# EAGLE design Rod_I2C_Extender_FFC (EAGLE 9.6.2)
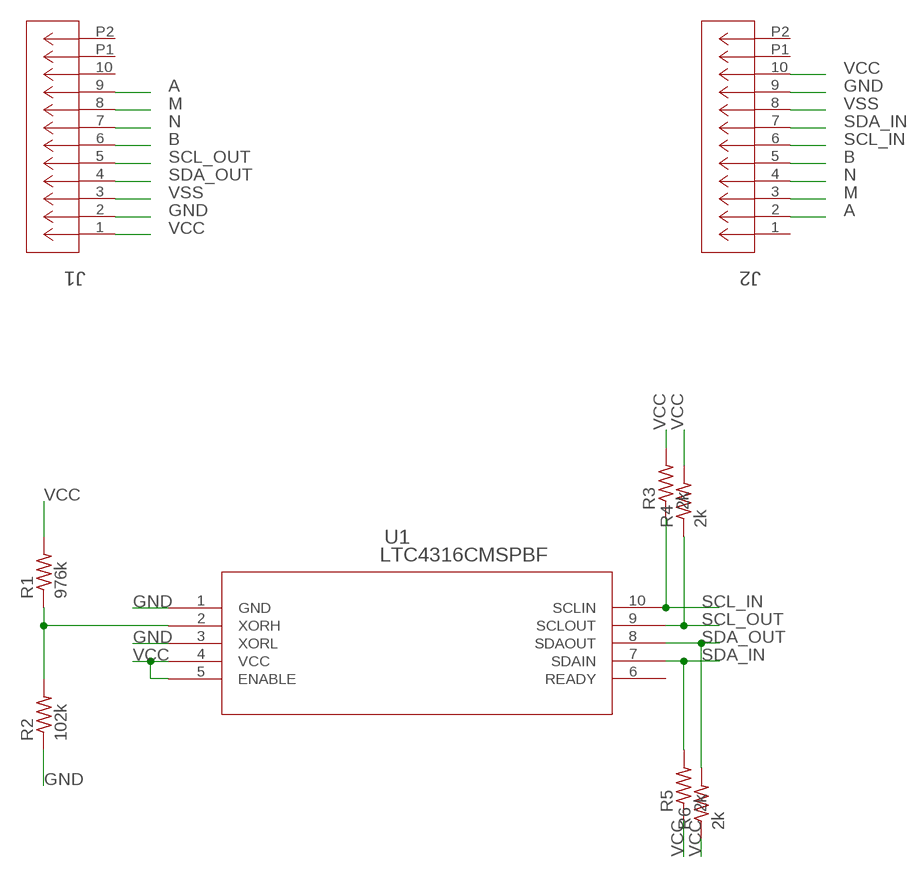
[diagram p0: schematic, sheet 1]

## Parts
J1  522711079  [CON_522711079_MOL]
J2  522711079  [CON_522711079_MOL]
R1  976k  R-US_R0603  [R0603]
R2  102k  R-US_R0603  [R0603]
R3  2k  R-US_R0603  [R0603]
R4  2k  R-US_R0603  [R0603]
R5  2k  R-US_R0603  [R0603]
R6  2k  R-US_R0603  [R0603]
U1  LTC4316CMSPBF  [MSOP-10_MS]

## Nets
A: J1.9 J2.2
B: J1.6 J2.5
GND: J1.2 J2.9 R2.1 U1.1(GND) U1.3(XORL)
M: J1.8 J2.3
N: J1.7 J2.4
N$3: R1.1 R2.2 U1.2(XORH)
SCL_IN: J2.6 R3.1 U1.10(SCLIN)
SCL_OUT: J1.5 R4.1 U1.9(SCLOUT)
SDA_IN: J2.7 R5.2 U1.7(SDAIN)
SDA_OUT: J1.4 R6.2 U1.8(SDAOUT)
VCC: J1.1 J2.10 R1.2 R3.2 R4.2 R5.1 R6.1 U1.4(VCC) U1.5(ENABLE)
VSS: J1.3 J2.8
Unconnected: J1.10 J1.P1 J1.P2 J2.1 J2.P1 J2.P2 U1.6(READY)

## Library data of the parts
J1 J2 = 0522711079:522711079; COPYRIGHT: Copyright (C) 2023 Ultra Librarian. All rights reserved.; MANUFACTURER_PART_NUMBER: 522711079; MFR_NAME: Molex Connector Corporation
R1-R6 = adafruit:R-US_: RESISTOR, American symbol
U1 = LTC4316CMSPBF:LTC4316CMSPBF: Check prices <https://pricing.snapeda.com/parts/LTC4316CMS%23PBF/Analog%20Devices/view-part?ref=eda>; AVAILABILITY: In Stock; DESCRIPTION: Single I2C/SMBus Address Translator; MF: Analog Devices; MP: LTC4316CMS#PBF; PACKAGE: MSOP-10 Analog Devices; PRICE: None

## Board
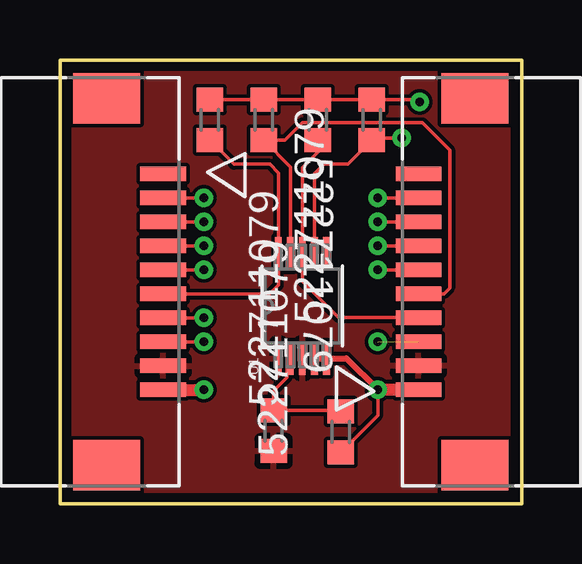
[diagram p1: board, top side]
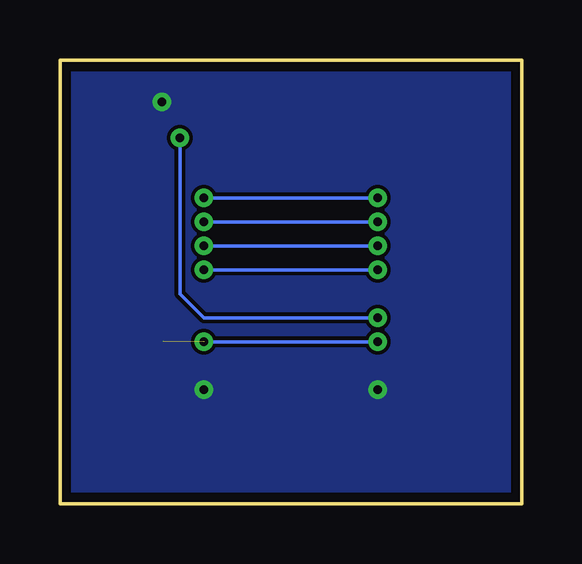
[diagram p2: board, bottom side, seen from below]

Size 19.25 x 18.5 mm. Coordinates in mm from the lower left corner, seen from the top.
Outline: 0,0 19.25,0 19.25,18.5 0,18.5 0,0
Copper layers (1*16): Top 0.035mm / dielectric 1.5mm / Bottom 0.035mm
Design rules "default *": minimum track width 6mil, minimum drill 0.35mm, track to track 6mil, track to pad 6mil, pad to pad 6mil, via to via 6mil, smd to smd 6mil, copper to edge 15mil, drill to drill 6mil, minimum pad ring 10mil, minimum via ring 8mil, stop-mask expansion 4mil, vias tented up to drill 0mil, thermal gap 10mil

### Footprints (pad centres in the part's own frame; a part is rotated, then mirrored left to right if it is on the bottom)
CON_522711079_MOL = smd 0.6 x 1.9: 1 -4.5,3.05; 2 -3.5,3.05; 3 -2.5,3.05; 4 -1.5,3.05; 5 -0.5,3.05; 6 0.5,3.05; 7 1.5,3.05; 8 2.5,3.05; 9 3.5,3.05; 10 4.5,3.05 | smd 2.1 x 2.8: P1 -7.65,0.7; P2 7.65,0.7
R0603 = smd 1 x 1.1: 1 -0.85,0; 2 0.85,0
MSOP-10_MS = smd 1.397 x 0.279: 1 -2.184,1.001; 2 -2.184,0.5; 3 -2.184,0; 4 -2.184,-0.5; 5 -2.184,-1.001; 6 2.184,-1.001; 7 2.184,-0.5; 8 2.184,0; 9 2.184,0.5; 10 2.184,1.001

### Placement (x,y rotation side)
J1  18,9.25 90 top
J2  1.25,9.25 270 top
R1  11.71,2.99 270 top
R2  8.91,3.04 90 top
R3  6.25,16 90 top
R4  8.5,16 90 top
R5  13,16 270 top
R6  10.75,16 270 top
U1  10.11,8.24 90 top

### Tracks (layer width: path | path; a pad name or v marks a point on that pad's centre or on a via)
A  (via drill 0.35)
  Top 0.152: J2.2 v6,12.75 | v6,12.75 | v13.25,12.75 J1.9 | J1.9
  Bottom 0.152: v6,12.75 v13.25,12.75
B  (via drill 0.35)
  Top 0.152: J2.5 | J2.5 v6,9.75 | v13.25,9.75 J1.6 | J1.6
  Bottom 0.152: v6,9.75 v13.25,9.75
GND
  pour Top: 0,18.5 0,0 19.25,0 19.25,18.5
M  (via drill 0.35)
  Top 0.152: J2.3 | J2.3 v6,11.75 | v13.25,11.75 J1.8 | J1.8
  Bottom 0.152: v6,11.75 v13.25,11.75
N  (via drill 0.35)
  Top 0.152: J2.4 | J2.4 v6,10.75 | v13.25,10.75 J1.7 | J1.7
  Bottom 0.152: v6,10.75 v13.25,10.75
N$3
  Top 0.152: 8.86,3.84 R2.2 | U1.2 9.48,5.92 9.48,5.26 8.91,4.7 R2.2 | R2.2 11.66,3.89 R1.1
SCL_IN
  Top 0.152: R3.1 7.25,14.15 8.75,14.15 9.11,13.79 U1.10 9.11,9.11 8.75,8.75 J2.6
SCL_OUT
  Top 0.152: 9.74,10.29 U1.9 9.61,14.04 R4.1 9.38,15.15 10.11,15.88 15.12,15.88 16.25,14.75 16.25,9 16,8.75 J1.5 | J1.5
SDA_IN  (via drill 0.35)
  Top 0.152: U1.7 10.61,13.76 11,14.15 12,14.15 R5.2 13.1,15.25 v14.25,15.25 | v6,7.75 | v6,7.75 J2.7
  Bottom 0.152: v6,7.75 13.25,7.75 14.25,8.75 v14.25,15.25
SDA_OUT
  Top 0.152: R6.2 10.75,14.65 10.11,14.01 U1.8 10.11,9.26 11.62,7.75 J1.4 | J1.4
VCC  (via drill 0.35)
  Top 0.152: v13.25,4.75 | R1.2 13.25,3.68 v13.25,4.75 | R3.2 R4.2 R6.1 R5.1 14.9,16.85 v15,16.75 | J2.10
  Top 0.254: U1.4 U1.5 11.94,6.06 v13.25,4.75
  Top 0.508: J2.10 v6,4.75 | v13.25,4.75 J1.1
  pour Bottom: 0,18.5 0,0 19.25,0 19.25,18.5
VSS  (via drill 0.35)  (1 unrouted)
  Top 0.152: J2.8 | J2.8 v6,6.75
  Bottom 0.152: v6,6.75 v13.25,6.75